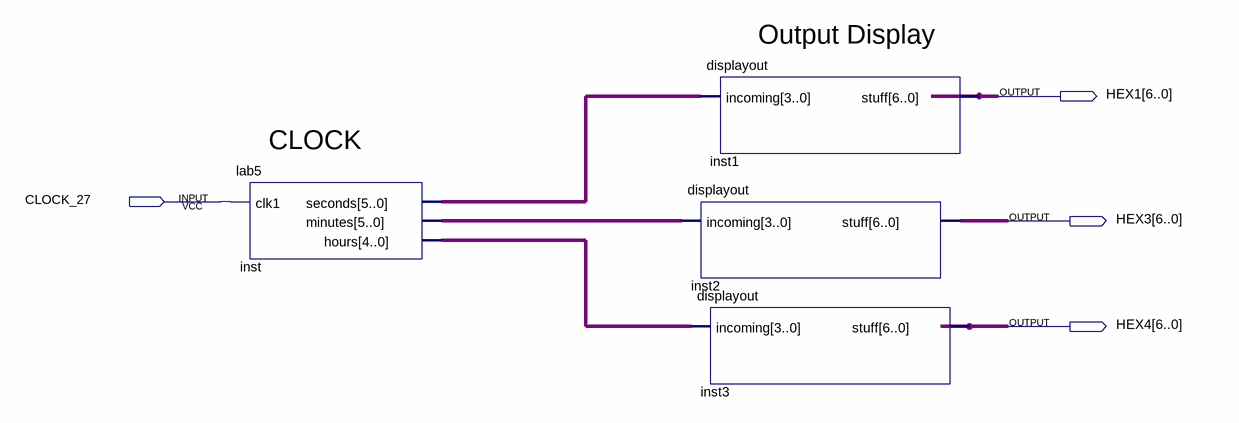
[diagram p0: schematic sheet]
// Quartus schematic main.bdf as structural Verilog: 4 symbols, 4 pins
module main (
  input  CLOCK_27,
  output [6:0] HEX1,
  output [6:0] HEX3,
  output [6:0] HEX4
);

  wire [4:0] inst_hours;
  wire [5:0] inst_minutes, inst_seconds;

  lab5 inst (.clk1(CLOCK_27), .seconds(inst_seconds), .minutes(inst_minutes), .hours(inst_hours));
  displayout inst1 (.incoming(inst_seconds), .stuff(HEX1));
  displayout inst2 (.incoming(inst_minutes), .stuff(HEX3));
  displayout inst3 (.incoming(inst_hours), .stuff(HEX4));

  // Notes on the sheet:
  //   Output Display
  //   CLOCK
endmodule
